# EAGLE design Heating_Pad (EAGLE 9.6.2)
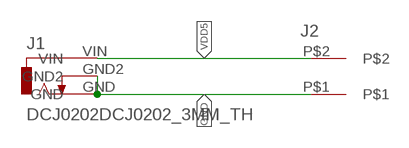
[diagram p0: schematic, sheet 1]

## Parts
J1  DCJ0202DCJ0202_3MM_TH  [DCJ0202_3MM_TH]
J2  2-pos  3.81MM_1_X_2_RT_ANGLE_PLUG_HEADER  [2_3.81MM_PITCH]

## Nets
GND: J1.GND J1.GND2 J2.P$1
VDD5: J1.VIN J2.P$2

## Library data of the parts
J1 = 3D_MIG_Controller:DCJ0202: DC POWER JACK Source: DCJ0202.pdf
J2 = 3D_MIG_Controller:3.81MM_1_X_2_RT_ANGLE_PLUG_HEADER: TERM BLOCK HDR 2POS 90DEG 3.81MM; PARTNO: 691322310002

## Board
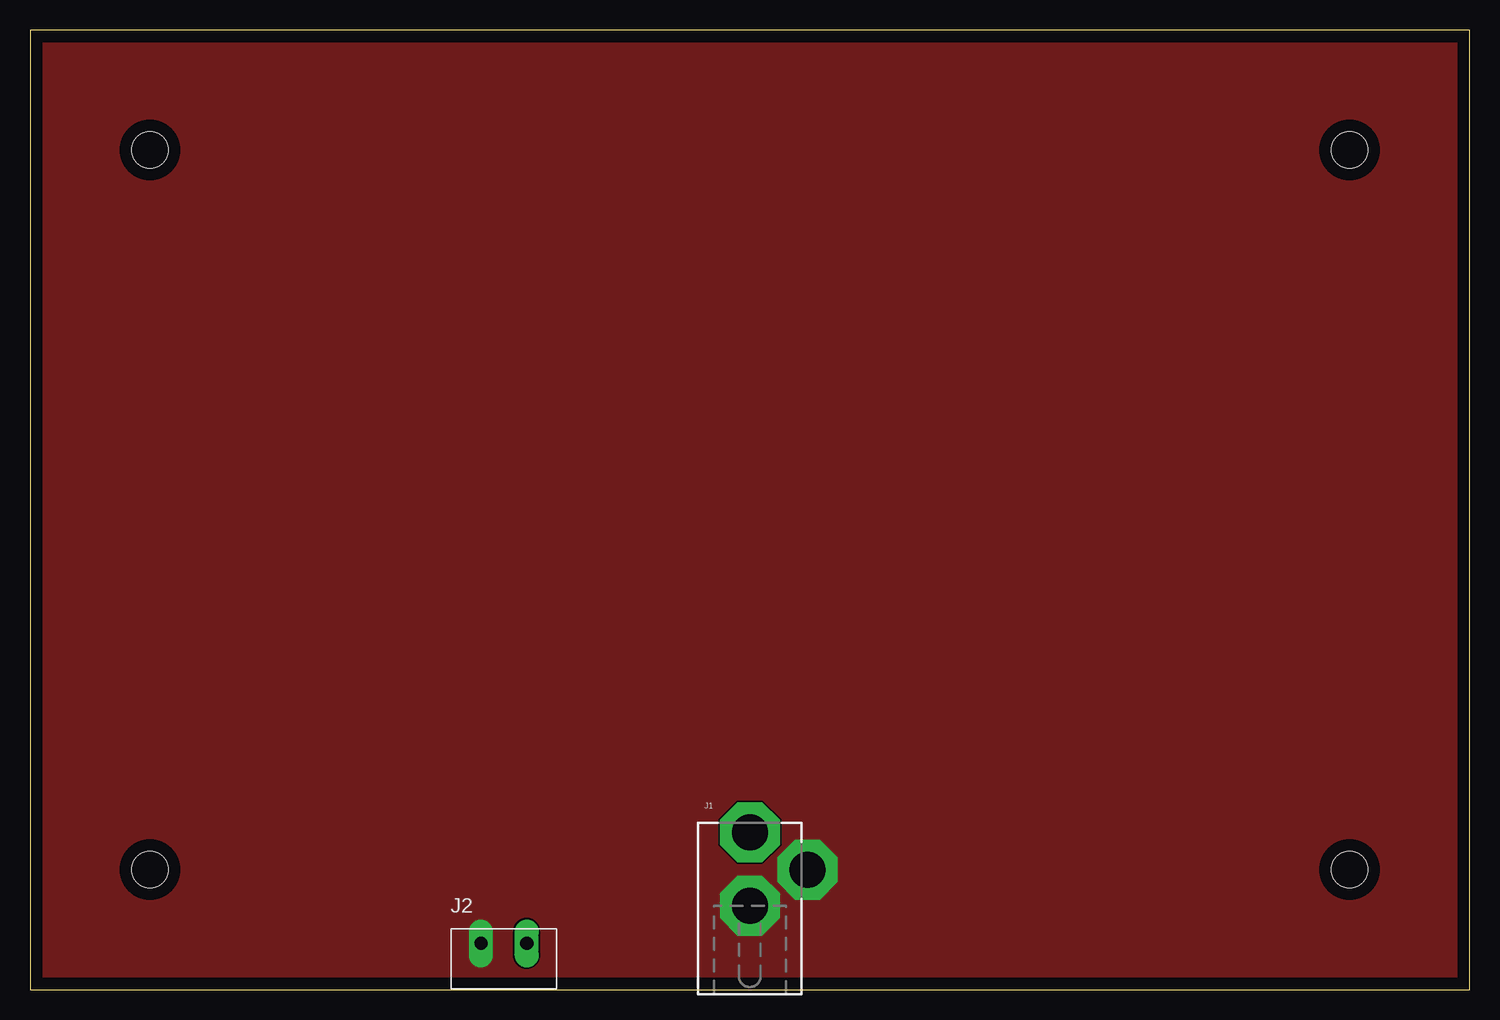
[diagram p1: board, top side]
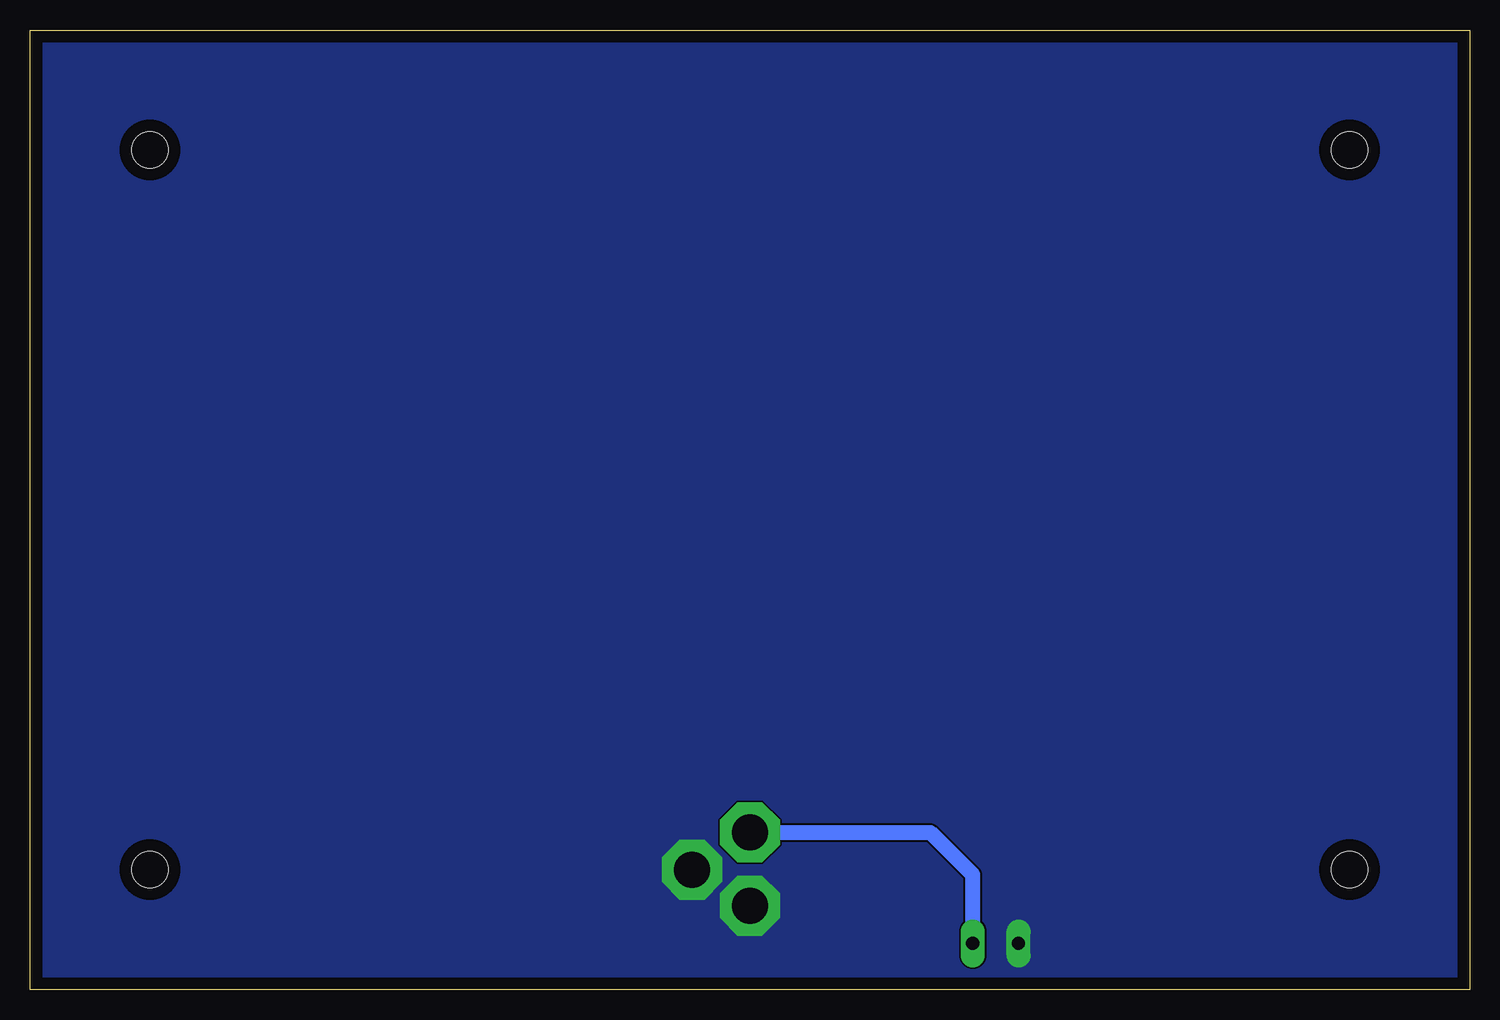
[diagram p2: board, bottom side, seen from below]

Size 120 x 80 mm. Coordinates in mm from the lower left corner, seen from the top.
Outline: 0,0 120,0 120,80 0,80 0,0
Copper layers (1*16): Top 0.035mm / dielectric 1.5mm / Bottom 0.035mm
Design rules "default": minimum track width 6mil, minimum drill 0.35mm, track to track 6mil, track to pad 6mil, pad to pad 6mil, via to via 6mil, smd to smd 6mil, copper to edge 40mil, drill to drill 6mil, minimum pad ring 10mil, minimum via ring 8mil, stop-mask expansion 4mil, vias tented up to drill 0mil, thermal gap 10mil
Holes 3 mm at 10,10 110,70 10,70 110,10

### Footprints (pad centres in the part's own frame; a part is rotated, then mirrored left to right if it is on the bottom)
DCJ0202_3MM_TH = drill 3 pad 5 octagon: GND 4.8,0; GND2 0,-3; VIN 0,3.1
2_3.81MM_PITCH = drill 1.1 pad 2 long: P$1 0,0; P$2 3.81,0

### Placement (x,y rotation side)
J1  60,10 0 top
J2  37.6,3.85 0 top

### Tracks (layer width: path | path; a pad name or v marks a point on that pad's centre or on a via)
GND
  pour Top (no thermals): 0,80 120,80 120,0 0,0
  pour Bottom (no thermals): 0,80 120,80 120,0 0,0
VDD5
  Bottom 1.27: J1.VIN 44.94,13.1 41.41,9.57 J2.P$2